# EAGLE design mae_radio_V14.06.13 (EAGLE 5.01)
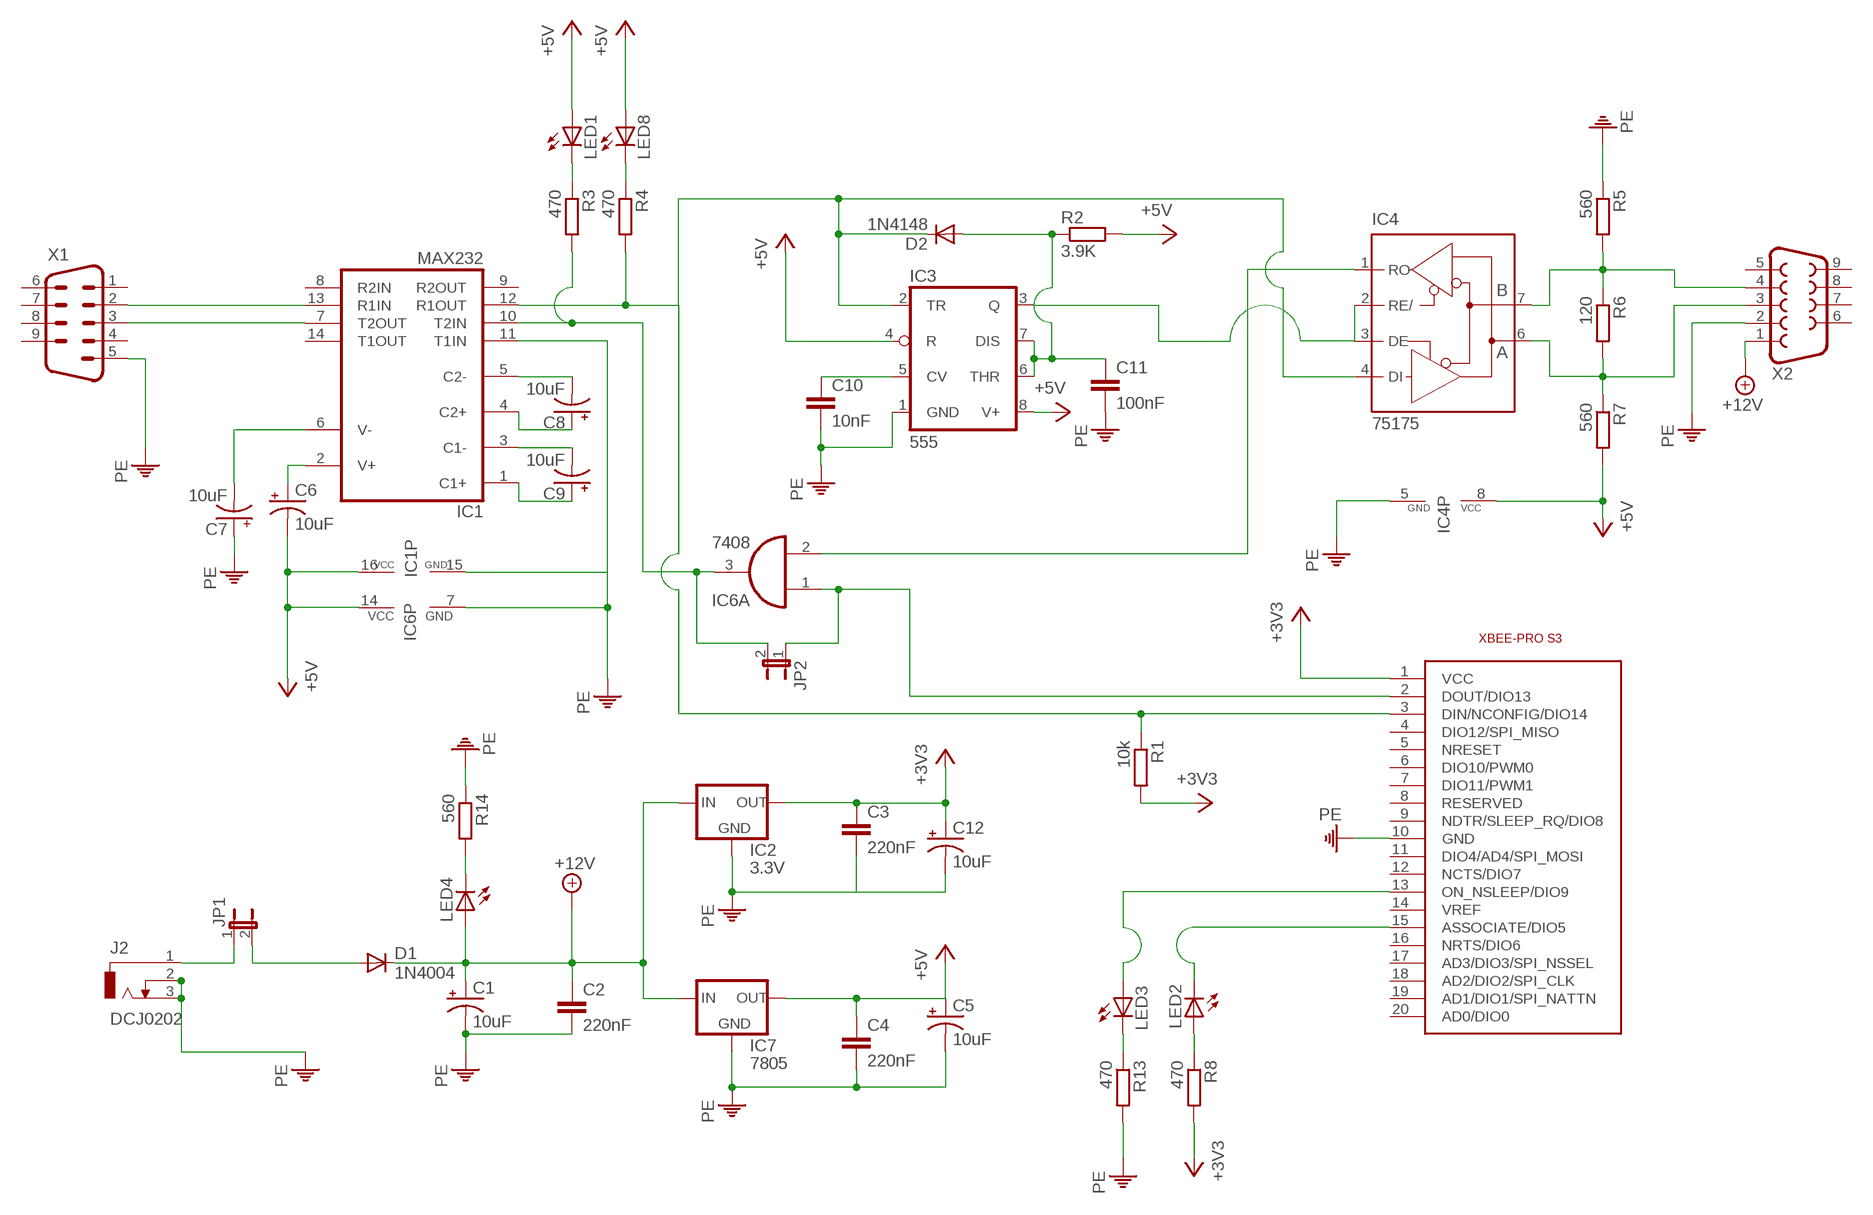
[diagram p0: schematic, sheet 1]

## Parts
C1  10uF  CPOL-USE2-5  [E2-5]
C2  220nF  C5/3.5  [C5B3.5]
C3  220nF  C5/3.5  [C5B3.5]
C4  220nF  C5/3.5  [C5B3.5]
C5  10uF  CPOL-USE2-5  [E2-5]
C6  10uF  CPOL-USE2-5  [E2-5]
C7  10uF  CPOL-USE2-5  [E2-5]
C8  10uF  CPOL-USE2-5  [E2-5]
C9  10uF  CPOL-USE2-5  [E2-5]
C10  10nF  C5/3.5  [C5B3.5]
C11  100nF  C5/3.5  [C5B3.5]
C12  10uF  CPOL-USE2-5  [E2-5]
D1  1N4004  [DO41-10]
D2  1N4148  [DO35-10]
IC1  MAX232  [DIL16]
IC2  3.3V  78XXL  [78XXL]
IC3  555  LM555N  [DIL08]
IC4  75175  MAX481CPA  [DIL08]
IC6  7408  74ALS08N  [DIL14]
IC7  7805  78XXL  [78XXL]
J2  DCJ0202  [DCJ0202]
JP1  JP1E  [JP1]
JP2  JP1E  [JP1]
LED1  LED3MM  [LED3MM]
LED2  LED3MM  [LED3MM]
LED3  LED3MM  [LED3MM]
LED4  LED5MM  [LED5MM]
LED8  LED3MM  [LED3MM]
R1  10k  R-EU_0207/7  [0207/7]
R2  3.9K  R-EU_0207/7  [0207/7]
R3  470  R-EU_0207/7  [0207/7]
R4  470  R-EU_0207/7  [0207/7]
R5  560  R-EU_0207/7  [0207/7]
R6  120  R-EU_0207/7  [0207/7]
R7  560  R-EU_0207/7  [0207/7]
R8  470  R-EU_0207/7  [0207/7]
R13  470  R-EU_0207/7  [0207/7]
R14  560  R-EU_0207/7  [0207/7]
U$1  XBEEPRO900  [XBEE-PRO]
X1  M09HP  [M09HP]
X2  F09HP  [F09HP]

## Nets
+3V3: C3.1 C12.+ IC2.OUT R1.2 R8.2 U$1.1(VCC)
+5V: C4.1 C5.+ C6.- IC1.16(VCC) IC3.4(R) IC3.8(V+) IC4.8(VCC) IC6.14(P:VCC) IC7.OUT LED1.A LED8.A R2.2 R7.2
+12V: C1.+ C2.1 D1.C IC2.IN IC7.IN LED4.A X2.1
DIN: D2.C IC1.12(R1OUT) IC3.2(TR) IC4.4(DI) R1.1 R4.2 U$1.3(DIN/NCONFIG/DIO14)
DOUT: IC6.1(A:I0) JP2.1 U$1.2(DOUT/DIO13)
N$1: J2.1 JP1.1
N$2: D1.A JP1.2
N$3: C9.+ IC1.1(C1+)
N$4: C10.1 IC3.5(CV)
N$5: IC4.1(RO) IC6.2(A:I1)
N$6: C9.- IC1.3(C1-)
N$7: C8.+ IC1.4(C2+)
N$8: LED3.A U$1.13(ON_NSLEEP/DIO9)
N$10: IC3.3(Q) IC4.2(RE/) IC4.3(DE)
N$11: LED2.A R8.1
N$12: C8.- IC1.5(C2-)
N$13: IC1.13(R1IN) X1.2
N$14: LED3.K(C) R13.1
N$15: LED4.K(C) R14.2
N$17: IC1.7(T2OUT) X1.3
N$18: C7.- IC1.6(V-)
N$19: C6.+ IC1.2(V+)
N$20: LED8.K(C) R4.1
N$21: LED1.K(C) R3.1
N$22: IC1.10(T2IN) IC6.3(A:O) JP2.2 R3.2
N$23: C11.1 D2.A IC3.6(THR) IC3.7(DIS) R2.1
N$24: LED2.K(C) U$1.15(ASSOCIATE/DIO5)
N$34: IC4.6(A) R6.2 R7.1 X2.3
N$35: IC4.7(B) R5.2 R6.1 X2.4
PE: C1.- C2.2 C3.2 C4.2 C5.- C7.+ C10.2 C11.2 C12.- IC1.11(T1IN) IC1.15(GND) IC2.GND IC3.1(GND) IC4.5(GND) IC6.7(P:GND) IC7.GND J2.2 J2.3 R5.1 R13.2 R14.1 U$1.10(GND) X1.5 X2.2
Unconnected: IC1.8(R2IN) IC1.9(R2OUT) IC1.14(T1OUT) IC6.4(B:I0) IC6.5(B:I1) IC6.6(B:O) IC6.8(C:O) IC6.9(C:I0) IC6.10(C:I1) IC6.11(D:O) IC6.12(D:I0) IC6.13(D:I1) U$1.4(DIO12/SPI_MISO) U$1.5(NRESET) U$1.6(DIO10/PWM0) U$1.7(DIO11/PWM1) U$1.8(RESERVED) U$1.9(NDTR/SLEEP_RQ/DIO8) U$1.11(DIO4/AD4/SPI_MOSI) U$1.12(NCTS/DIO7) U$1.14(VREF) U$1.16(NRTS/DIO6) U$1.17(AD3/DIO3/SPI_NSSEL) U$1.18(AD2/DIO2/SPI_CLK) U$1.19(AD1/DIO1/SPI_NATTN) U$1.20(AD0/DIO0) X1.1 X1.4 X1.6 X1.7 X1.8 X1.9 X2.5 X2.6 X2.7 X2.8 X2.9

## Library data of the parts
C1 C5-C9 C12 = rcl:CPOL-US: POLARIZED CAPACITOR, American symbol
C2-C4 C10 C11 = capacitor-wima:C: CAPACITOR naming: grid - package width
D1 = diode:1N4004: DIODE general purpose rectifier, 1 A
D2 = diode:1N4148: DIODE high speed (Philips)
IC1 = maxim:MAX232: RS232 TRANSEIVER
IC2 IC7 = v-reg:78XXL: VOLTAGE REGULATOR
IC3 = linear:*555: TIMER
IC4 = maxim:MAX481CPA: RS485 TRANSEIVER
IC6 = 74xx-eu:74*08: Quad 2-input AND gate
J2 = con-jack:DCJ0202: DC POWER JACK Source: DCJ0202.pdf
JP1 JP2 = jumper:JP1E: JUMPER
LED1-LED4 LED8 = led:LED: LED OSRAM: - CHIPLED LG R971, LG N971, LY N971, LG Q971, LY Q971, LO R971, LY R971 LH N974, LH R974 LS Q976, LO Q976, LY Q976 LO Q996 - Hyper CHIPLED LW Q18S LB Q993, LB Q99A, LB R99A - SideLED LS A670, LO A670, LY A670, LG A670, LP A670 LB A673, LV A673, LT A673, LW A673 LH A674 LY A675 LS A676, LA A676, LO A676, LY A676, LW A676 LS A679, LY A679, LG A679 - Hyper Micro SIDELED® LS Y876, LA Y876, LO Y876, LY Y876 LT Y87S - SmartLED LW L88C, LW L88S LB L89C, LB L89S, LG L890 LS L89K, LO L89K, LY L89K LS L896, LA L896, LO L896, LY L896 - TOPLED LS T670, LO T670, LY T670, LG T670, LP T670 LSG T670, LSP T670, LSY T670, LOP T670, LYG T670 LG T671, LOG T671, LSG T671 LB T673, LV T673, LT T673, LW T673 LH T674 LS T676, LA T676, LO T676, LY T676, LB T676, LH T676, LSB T676, LW T676 LB T67C, LV T67C, LT T67C, LS T67K, LO T67K, LY T67K, LW E67C LS E67B, LA E67B, LO E67B, LY E67B, LB E67C, LV E67C, LT E67C LW T67C LS T679, LY T679, LG T679 LS T770, LO T770, LY T770, LG T770, LP T770 LB T773, LV T773, LT T773, LW T773 LH T774 LS E675, LA E675, LY E675, LS T675 LS T776, LA T776, LO T776, LY T776, LB T776 LHGB T686 LT T68C, LB T68C - Hyper Mini TOPLED® LB M676 - Mini TOPLED Santana® LG M470 LS M47K, LO M47K, LY M47K Source: http://www.osram.convergy.de - LUMILED® LXK2-PW12-R00, LXK2-PW12-S00, LXK2-PW14-U00, LXK2-PW14-V00 LXK2-PM12-R00, LXK2-PM12-S00, LXK2-PM14-U00 LXK2-PE12-Q00, LXK2-PE12-R00, LXK2-PE12-S00, LXK2-PE14-T00, LXK2-PE14-U00 LXK2-PB12-K00, LXK2-PB12-L00, LXK2-PB12-M00, LXK2-PB14-N00, LXK2-PB14-P00, LXK2-PB14-Q00 LXK2-PR12-L00, LXK2-PR12-M00, LXK2-PR14-Q00, LXK2-PR14-R00 LXK2-PD12-Q00, LXK2-PD12-R00, LXK2-PD12-S00 LXK2-PH12-R00, LXK2-PH12-S00 LXK2-PL12-P00, LXK2-PL12-Q00, LXK2-PL12-R00 Source: www.luxeon.com
R1-R8 R13 R14 = resistor:R-EU_: RESISTOR, European symbol
U$1 = maxstream2:XBEEPRO900
X1 = con-subd:M09: SUB-D
X2 = con-subd:F09: SUB-D

## Board
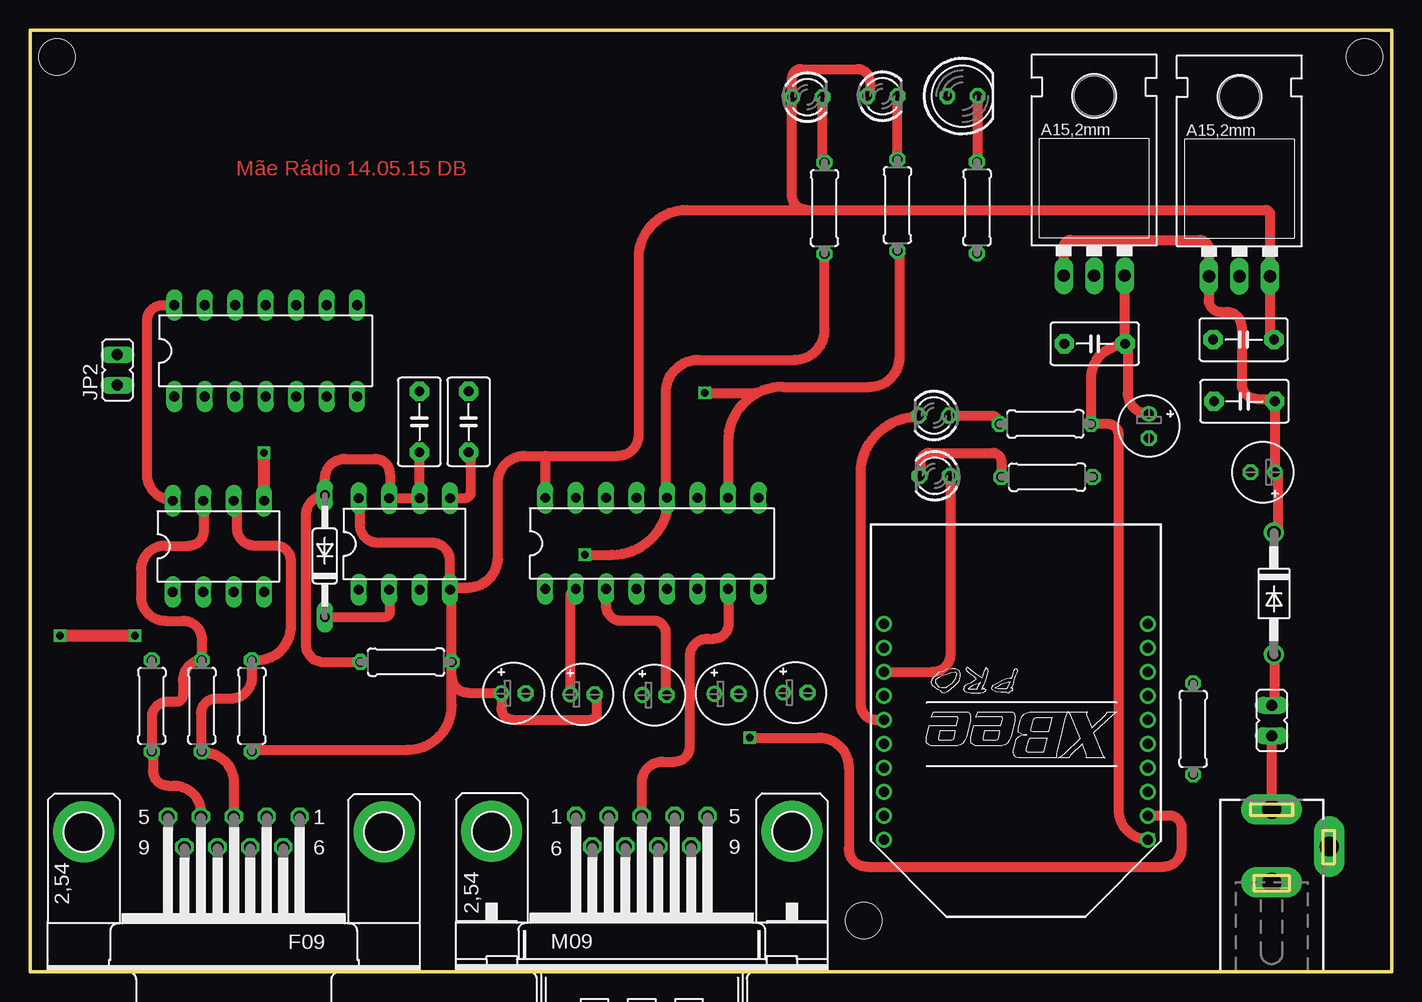
[diagram p1: board, top side]
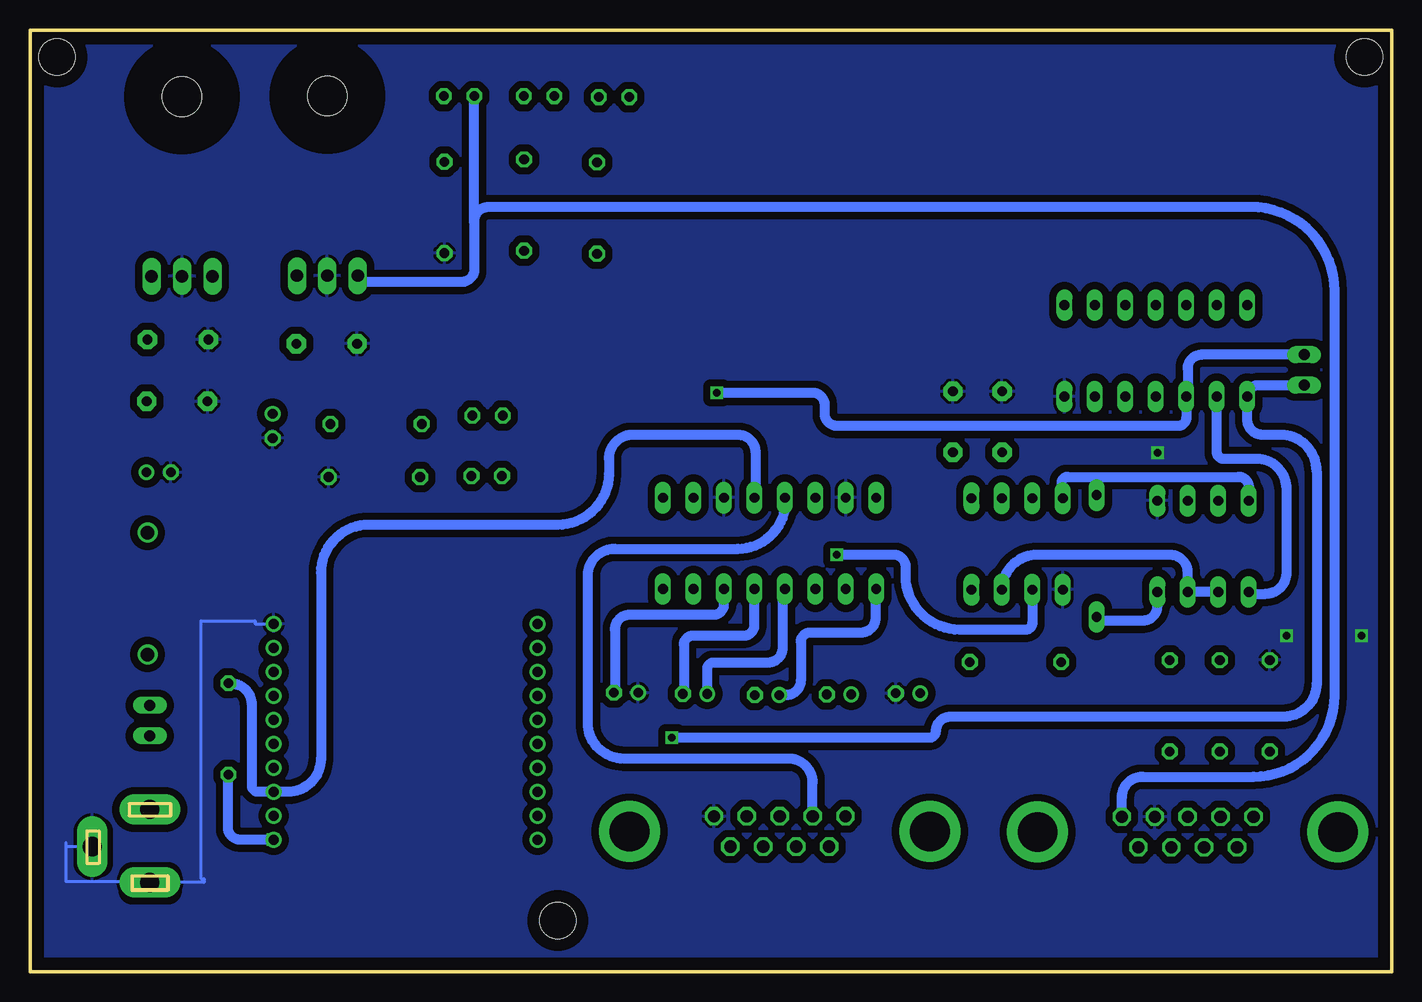
[diagram p2: board, bottom side, seen from below]

Size 113.5 x 78.5 mm. Coordinates in mm from the lower left corner, seen from the top.
Outline: 1.75,0 113.5,0 113.5,78.5 0,78.5 0,0 1.75,0
Outline: 1.75,0 1.5,0
Outline: 102,6.75 105,6.75 105,8 102,8 102,6.75
Outline: 107.75,11.75 107.75,9 108.75,9 108.75,11.75 107.75,11.75
Outline: 105.25,14 105.25,13 101.75,13 101.75,14 105.25,14
Copper layers (1*16): Top 0.035mm / dielectric 1.5mm / Bottom 0.035mm
Design rules "default": minimum track width 10mil, minimum drill 24mil, track to track 8mil, track to pad 8mil, pad to pad 8mil, via to via 8mil, smd to smd 8mil, copper to edge 40mil, drill to drill 8mil, minimum pad ring 10mil, minimum via ring 8mil, stop-mask expansion 4mil, vias tented up to drill 0mil, thermal gap 10mil
Holes 3 mm at 2.25,76.25 111.25,76.25 69.5,4.25

### Footprints (pad centres in the part's own frame; a part is rotated, then mirrored left to right if it is on the bottom)
E2-5 = drill 0.813 pad 1.27 round: + -1.016,0 | drill 0.813 pad 1.27 octagon: - 1.016,0
C5B3.5 = drill 0.813 pad 1.6 octagon: 1 -2.54,0; 2 2.54,0
DO41-10 = drill 1.118 round: A 5.08,0; C -5.08,0
DO35-10 = drill 0.813 long: A 5.08,0; C -5.08,0
DIL16 = drill 0.813 long: 1 -8.89,-3.81; 2 -6.35,-3.81; 3 -3.81,-3.81; 4 -1.27,-3.81; 5 1.27,-3.81; 6 3.81,-3.81; 7 6.35,-3.81; 8 8.89,-3.81; 9 8.89,3.81; 10 6.35,3.81; 11 3.81,3.81; 12 1.27,3.81; 13 -1.27,3.81; 14 -3.81,3.81; 15 -6.35,3.81; 16 -8.89,3.81
78XXL = drill 1.016 long: GND 0,-3.81; IN -2.54,-3.81; OUT 2.54,-3.81 | hole 3.302: 0,11.176
DIL08 = drill 0.813 long: 1 -3.81,-3.81; 2 -1.27,-3.81; 3 1.27,-3.81; 4 3.81,-3.81; 5 3.81,3.81; 6 1.27,3.81; 7 -1.27,3.81; 8 -3.81,3.81
DIL14 = drill 0.813 long: 1 -7.62,-3.81; 2 -5.08,-3.81; 3 -2.54,-3.81; 4 0,-3.81; 5 2.54,-3.81; 6 5.08,-3.81; 7 7.62,-3.81; 8 7.62,3.81; 9 5.08,3.81; 10 2.54,3.81; 11 0,3.81; 12 -2.54,3.81; 13 -5.08,3.81; 14 -7.62,3.81
DCJ0202 = drill 1.6 pad 2.54 long: 1 0,3.1; 2 4.8,0; 3 0,-3
JP1 = drill 0.914 long: 1 0,-1.27; 2 0,1.27
LED3MM = drill 0.813 octagon: A -1.27,0; K 1.27,0
LED5MM = drill 0.813 octagon: A -1.27,0; K 1.27,0
0207/7 = drill 0.813 octagon: 1 -3.81,0; 2 3.81,0
XBEE-PRO = drill 0.8 pad 1.27 round: 1 -11,9; 2 -11,7; 3 -11,5; 4 -11,3; 5 -11,1; 6 -11,-1; 7 -11,-3; 8 -11,-5; 9 -11,-7; 10 -11,-9; 11 11,-9; 12 11,-7; 13 11,-5; 14 11,-3; 15 11,-1; 16 11,1; 17 11,3; 18 11,5; 19 11,7; 20 11,9
M09HP = drill 1.016 octagon: 1 -5.486,1.27; 2 -2.743,1.27; 3 0,1.27; 4 2.743,1.27; 5 5.486,1.27; 6 -4.115,-1.27; 7 -1.372,-1.27; 8 1.372,-1.27; 9 4.115,-1.27 | drill 3.302 pad 5.08 round: G1 -12.522,0; G2 12.522,0
F09HP = drill 1.016 octagon: 1 -5.486,-1.27; 2 -2.743,-1.27; 3 0,-1.27; 4 2.743,-1.27; 5 5.486,-1.27; 6 -4.115,1.27; 7 -1.372,1.27; 8 1.372,1.27; 9 4.115,1.27 | drill 3.302 pad 5.08 round: G1 -12.522,0; G2 12.522,0

### Placement (x,y rotation side)
C1  102.77,41.62 180 top
C2  101.24,47.54 180 top
C3  88.76,52.34 180 top
C4  101.17,52.68 180 top
C5  40.31,23.2 0 top
C6  46.06,23.1 0 top
C7  63.81,23.25 0 top
C8  58.06,23.15 0 top
C9  52.06,23.05 0 top
C10  36.57,45.83 90 top
C11  32.46,45.83 90 top
C12  93.28,45.48 270 top
D1  103.7,31.51 270 top
D2  24.58,34.64 90 top
IC1  51.84,35.7 0 top
IC2  88.71,61.82 0 top
IC3  31.21,35.65 0 top
IC4  15.71,35.45 0 top
IC6  19.65,51.75 0 top
IC7  100.83,61.77 0 top
J2  103.51,10.42 0 top
JP1  103.51,20.93 0 top
JP2  7.29,50.16 0 top
LED1  71.06,72.99 0 top
LED2  75.35,46.35 180 top
LED3  75.43,41.32 180 top
LED4  77.73,72.99 0 top
LED8  64.81,72.91 0 top
R1  96.96,20.23 270 top
R2  31.35,25.8 0 top
R3  72.31,63.9 270 top
R4  66.23,63.65 270 top
R5  10.15,22.15 270 top
R6  14.32,22.15 270 top
R7  18.49,22.15 270 top
R8  84.65,45.65 0 top
R13  84.79,41.22 0 top
R14  78.95,63.7 90 top
U$1  82.19,19.98 180 top
X1  51,11.68 0 top
X2  16.99,11.63 180 top

### Tracks (layer width: path | path; a pad name or v marks a point on that pad's centre or on a via)
+3V3  (via drill 0.6)
  Top 0.813: 91.5,52.25 arc90 91.41,52.34 C3.1 91.3,52.3 arc-90 91.25,52.25 arc90 88.46,49.46 R8.2 89.85,45.65 arc-90 90.75,44.75 90.75,13.5 arc90 v93.25,11 arc-90 93.23,10.98 U$1.1 | IC2.OUT 91.25,52.5 arc90 91.5,52.25 | C12.+ 93.25,46.5 arc-90 91.5,48.25 91.5,52.25
  Bottom 0.813: v93.25,11 96,11 arc90 97,12 97,16.25 arc-90 96.96,16.29 R1.2
+5V
  Top 0.813: LED1.A 69.76,72.99 arc-90 69.75,73 arc90 70,73.25 70,74.25 arc90 69,75.25 64.25,75.25 arc90 63.54,74.54 LED8.A 63.54,72.96 arc90 63.5,73 63.5,64.75 arc90 64.75,63.5 | C4.1 103.71,52.71 arc-90 103.75,52.75 arc-90 103.37,53.13 IC7.OUT 103.37,63.13 arc90 103,63.5 64.75,63.5 | C6.- 47.08,23.08 arc-90 47,23 arc-90 47.25,22.75 47.25,21.5 arc-90 46.75,21 40.25,21 arc-90 39.29,21.96 C5.+ 39.45,23.2 arc90 39.5,23.25 36.5,23.25 arc-90 35.16,24.59 | 64.75,63.5 54.75,63.5 arc90 50.75,59.5 50.75,44.75 arc-90 49,43 43,43 | IC3.8 27.4,39.35 arc90 27.5,39.25 27.5,37.25 arc90 29,35.75 33.5,35.75 arc-90 35,34.25 35,32 | 43,43 41.25,43 arc90 39,40.75 39,34.5 | 39,34.5 arc-90 36.52,32.02 35.02,32.02 | 39,34.5 39,37.75 | 39,34.5 39,37.5 | 36.5,32 arc90 39,34.5 | 36.5,32 arc90 39,34.5 | 35.02,32.02 IC3.4 | 35,32 arc90 35.02,32.02 | 35,32 36.5,32 | 35,32 arc-90 35.16,31.84 R2.2 35.16,24.59 | 35.16,24.59 35.16,22.16 arc-90 31.5,18.5 18.75,18.5 arc90 18.5,18.25 arc-90 18.49,18.26 R7.2 18.66,18.34 arc-90 18.75,18.25 | IC1.16 42.95,42.95 arc-90 43,43 | IC6.14 11.06,55.56 arc90 9.75,54.25 9.75,41.5 arc90 12,39.25 arc90 11.99,39.26 IC4.8
  Bottom 0.813: IC4.8 11.9,40.4 arc-90 12.75,41.25 27,41.25 arc-90 27.5,40.75 27.5,39.5 arc-90 27.46,39.46 IC3.8
+12V
  Top 0.813: 104,41.62 104,41.75 | 104,41.62 C1.+ 103.75,41.62 103.75,47.5 | D1.C 104,36.59 104,41.62 | 103.75,47.5 103.75,47.54 C2.1 C2.1 arc-90 103.75,47.5 | 103.75,47.5 arc90 103.5,47.75 102.25,47.75 arc-90 101,49 101,53.75 arc90 99.75,55 99.25,55 arc-90 98.25,56 98.25,57.92 arc-90 IC7.IN arc90 98.25,58 98.25,60.25 arc90 97.5,61 86.75,61 arc90 86.17,60.42 IC2.IN
  Bottom 0.813: 76.46,62.5 76.46,58.54 arc90 77.5,57.5 85.75,57.5 arc90 86.25,58 arc90 86.24,58.01 IC2.IN | 76.46,62.5 LED4.A | X2.1 22.48,14.52 arc90 20.75,16.25 11.5,16.25 arc-90 4.75,23 4.75,56.75 arc-90 11.75,63.75 75.25,63.75 arc-90 76.5,62.5 76.46,62.5
DIN  (via drill 0.6)
  Top 0.813: R4.2 66.23,53.48 arc-90 63.75,51 55.75,51 arc90 53,48.25 53,39.75 arc90 53.25,39.5 | 53.25,39.5 arc90 53.24,39.51 | D2.C 29.56,29.56 arc90 30,30 30,31.5 arc90 29.75,31.75 arc-90 29.84,31.84 IC3.2 | 53.25,39.5 arc90 53.24,39.51 | 53.24,39.51 IC1.12 | v46.25,34.75 48.5,34.75 arc90 53.25,39.5
  Bottom 0.813: IC1.12 53.01,39.51 arc90 53,39.5 53,43.25 arc-90 54.5,44.75 63.25,44.75 arc-90 65.25,42.75 65.25,41.5 arc90 69.5,37.25 85.25,37.25 arc-90 89.25,33.25 89.25,17.75 arc90 92.02,14.98 U$1.3 94.48,14.98 arc90 95,15.5 95,22.25 arc-90 96.75,24 arc-90 96.79,24.04 R1.1 | IC4.4 19.52,30.48 arc90 20.75,29.25 24.5,29.25 arc90 24.75,29.5 arc90 24.69,29.56 D2.C | IC3.2 29.94,29.06 arc90 30.5,28.5 36,28.5 arc90 40.5,33 40.5,33.75 arc-90 41.5,34.75 v46.25,34.75
DOUT  (via drill 0.6)
  Top 0.813: v60,19.5 65.75,19.5 arc-90 68.25,17 68.25,10.25 arc90 69.75,8.75 94.5,8.75 arc90 96,10.25 96,12 arc90 95,13 93.25,13 arc-90 93.23,12.98 U$1.2
  Bottom 0.813: v60,19.5 38.5,19.5 arc-90 38,20 arc90 36.75,21.25 9,21.25 arc-90 6.25,24 6.25,41.75 arc-90 9.25,44.75 10.75,44.75 arc90 12.03,46.03 IC6.1 12.03,47.97 arc90 12,48 arc90 11.11,48.89 JP2.1
N$1
  Top 0.813: JP1.1 J2.1
N$2
  Top 0.813: D1.A 103.75,26.43 103.75,22.2 JP1.2
N$3
  Bottom 0.813: C9.+ 50.45,23.05 arc-90 49.25,24.25 49.25,27.5 arc90 48.5,28.25 44.25,28.25 arc-90 43,29.5 43,31.75 arc-90 42.95,31.8 IC1.1
N$4
  Top 0.813: IC3.5 36.21,39.46 arc90 36.75,40 36.75,43 arc-90 36.57,43.18 C10.1
N$5
  Bottom 0.813: IC6.2 14.57,43.32 arc-90 14,42.75 11.25,42.75 arc90 8.75,40.25 8.75,33.25 arc90 10.5,31.5 12,31.5 arc-90 11.9,31.6 IC4.1
N$6
  Top 0.813: IC1.3 48.03,30.47 arc90 49.25,29.25 52,29.25 arc-90 53,28.25 53,23.25 arc-90 53.08,23.17 C9.-
N$7
  Bottom 0.813: C8.+ 57.04,25.21 arc90 56.5,25.75 52,25.75 arc-90 50.75,27 50.75,31.5 arc90 50.5,31.75 arc90 50.57,31.82 IC1.4
N$8
  Top 0.813: U$1.13 75.23,24.98 arc90 76.75,26.5 76.75,41.25 arc-90 76.7,41.3 LED3.A
N$10
  Bottom 0.813: IC4.2 16.86,31.64 arc-90 17,31.5 arc-90 16.98,31.52 IC4.3 16.98,33.23 arc-90 18.5,34.75 29.5,34.75 arc-90 32.5,31.75 arc-90 32.48,31.77 IC3.3
N$11
  Top 0.813: R8.1 R8.1 arc90 80.75,45.75 arc90 80.15,46.35 LED2.A
N$12
  Bottom 0.813: IC1.5 53.11,28.89 arc90 54,28 58.25,28 arc-90 59,27.25 59,23.25 arc-90 59.08,23.17 C8.-
N$13
  Bottom 0.813: X1.2 48.26,15.76 arc-90 50.25,17.75 64,17.75 arc90 67,20.75 67,33 arc90 64.75,35.25 54.5,35.25 arc-90 50.5,39.25 arc90 50.57,39.32 IC1.13
N$14
  Top 0.813: R13.1 80.98,42.52 arc90 80.25,43.25 75,43.25 arc90 74.25,42.5 74.25,41.25 arc90 74.18,41.32 LED3.K
N$15
  Top 0.813: R14.2 78.99,67.51 arc-90 79,67.5 LED4.K
N$17
  Top 0.813: X1.3 51,15.75 arc-90 52.75,17.5 53.75,17.5 arc90 55,18.75 55,26.25 arc-90 56.5,27.75 57,27.75 arc90 58.25,29 58.25,31.5 arc-90 58.19,31.56 IC1.7
N$18
  Bottom 0.813: IC1.6 55.65,30.6 arc90 56.5,29.75 63.5,29.75 arc-90 64.75,28.5 64.75,23.5 arc90 65,23.25 C7.-
N$19
  Top 0.813: IC1.2 45.49,31.76 arc90 45.5,31.75 arc90 45.04,31.29 C6.+
N$20
  Top 0.813: R4.1 66.23,67.73 arc-90 66.25,67.75 arc-90 66.08,67.92 LED8.K
N$21
  Top 0.813: R3.1 72.46,67.71 arc90 72.5,67.75 arc-90 72.33,67.92 LED1.K
N$22  (via drill 0.6)
  Top 0.254: 60.5,48.25 arc25 62.75,48.75
  Top 0.813: IC1.10 58.19,44.19 arc-90 62.75,48.75 70,48.75 arc90 72.5,51.25 72.5,59.5 arc90 72.25,59.75 arc90 72.31,59.81 R3.2 | v56.25,48.25 60.5,48.25
  Bottom 0.813: v56.25,48.25 48.25,48.25 arc90 47.25,47.25 47.25,46.5 arc-90 46.25,45.5 17.75,45.5 arc-90 17.11,46.14 IC6.3 17.11,47.89 arc90 17.25,47.75 arc-90 17,48 17,50.25 arc90 15.82,51.43 JP2.2
N$23
  Top 0.813: R2.1 24.45,25.8 arc-90 23,27.25 23,38 arc-90 24.75,39.75 arc-90 24.72,39.72 D2.A 24.58,41.08 arc-90 26.25,42.75 28.75,42.75 arc-90 30,41.5 30,39.25 arc-90 29.94,39.31 IC3.7 29.96,39.46 arc90 30,39.5 arc90 30.04,39.46 IC3.6 32.48,43.23 arc-90 32.5,43.25 arc-90 C11.1
N$24
  Top 0.813: U$1.15 70.52,20.98 arc-90 69.25,22.25 69.25,41.5 arc-90 74,46.25 arc90 74.08,46.33 LED2.K
N$34
  Top 0.813: X2.3 16.99,15.76 arc90 14.5,18.25 arc90 14.41,18.34 R6.2 14.34,18.34 arc90 14.5,18.5 arc-90 14.25,18.75 14.25,21.5 arc-90 15.5,22.75 16.75,22.75 arc90 18.49,24.49 R7.1 18.96,25.96 arc90 21.75,28.75 21.75,34.25 arc90 20.5,35.5 18.75,35.5 arc-90 17.25,37 17.25,38.75 arc90 17,39 arc-90 16.98,39.02 IC4.6
N$35
  Top 0.813: X2.4 14.25,13.25 arc90 12,15.5 11.5,15.5 arc-90 10.25,16.75 10.25,18.25 arc90 R5.2 10.15,21.15 arc-90 11.5,22.5 12.25,22.5 arc90 12.75,23 12.75,24.25 arc-90 14.5,26 arc-90 14.46,25.96 R6.1 14.32,27.68 arc90 12.75,29.25 11.25,29.25 arc-90 9.25,31.25 9.25,33.5 arc-90 11.25,35.5 13.25,35.5 arc90 14.5,36.75 14.5,39.25 arc90 14.49,39.26 IC4.7
PE  (via drill 0.6)
  Top 1.016: v8.75,28 v2.5,28 | IC4.5 19.5,39.26 v19.5,43.25
  Bottom 0.254: 110.5,10.42 J2.2 | 110.5,10.42 110.5,10.75 | 110.5,10.42 110.5,7.5 103.5,7.5 J2.3 99,7.42 99,7.75 99.25,7.75 99.25,29.25 94.75,29.25 94.75,29 93,29
  pour Bottom (isolate 0.61): 0.5,0.5 113,0.5 113,78 0.5,78

### Text on the board
Top: Mãe Rádio 14.05.15 DB